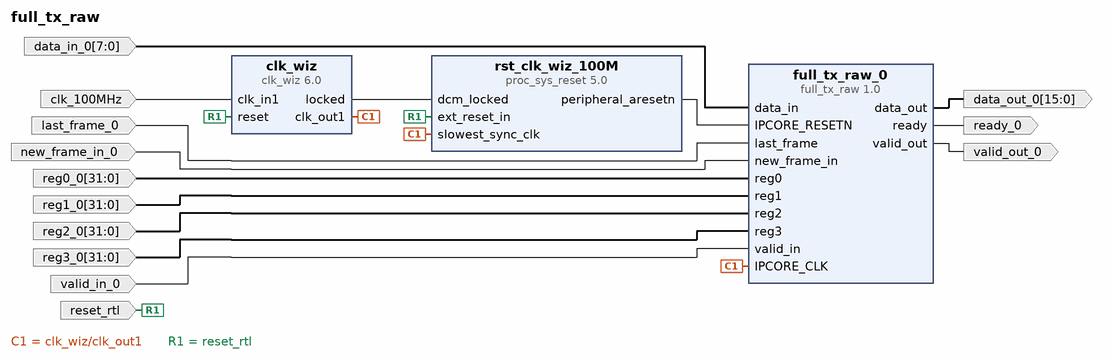
[diagram p0: block diagram of the top level]
# Vivado block design full_tx_raw, xc7z010clg400-1, Vivado 2023.2
create_bd_design full_tx_raw

create_bd_port -dir I -type clk clk_100MHz
set_property -dict {CONFIG.FREQ_HZ 100000000} [get_bd_ports clk_100MHz]
create_bd_port -dir I -type rst reset_rtl
set_property -dict {CONFIG.POLARITY ACTIVE_HIGH} [get_bd_ports reset_rtl]
create_bd_port -dir I -from 7 -to 0 data_in_0
create_bd_port -dir O -from 15 -to 0 data_out_0
create_bd_port -dir I last_frame_0
create_bd_port -dir I new_frame_in_0
create_bd_port -dir O ready_0
create_bd_port -dir I -from 31 -to 0 reg0_0
create_bd_port -dir I -from 31 -to 0 reg1_0
create_bd_port -dir I -from 31 -to 0 reg2_0
create_bd_port -dir I -from 31 -to 0 reg3_0
create_bd_port -dir I valid_in_0
create_bd_port -dir O valid_out_0

create_bd_cell -type ip -vlnv user.org:ip:full_tx_raw:1.0 full_tx_raw_0
create_bd_cell -type ip -vlnv xilinx.com:ip:clk_wiz:6.0 clk_wiz
create_bd_cell -type ip -vlnv xilinx.com:ip:proc_sys_reset:5.0 rst_clk_wiz_100M

# ---- connections ----

connect_bd_net [get_bd_ports clk_100MHz] [get_bd_pins clk_wiz/clk_in1]
connect_bd_net [get_bd_pins clk_wiz/clk_out1] [get_bd_pins full_tx_raw_0/IPCORE_CLK] [get_bd_pins rst_clk_wiz_100M/slowest_sync_clk]
connect_bd_net [get_bd_pins clk_wiz/locked] [get_bd_pins rst_clk_wiz_100M/dcm_locked]
connect_bd_net -net data_in_0_1 [get_bd_ports data_in_0] [get_bd_pins full_tx_raw_0/data_in]
connect_bd_net [get_bd_pins full_tx_raw_0/data_out] [get_bd_ports data_out_0]
connect_bd_net [get_bd_pins full_tx_raw_0/ready] [get_bd_ports ready_0]
connect_bd_net [get_bd_pins full_tx_raw_0/valid_out] [get_bd_ports valid_out_0]
connect_bd_net -net last_frame_0_1 [get_bd_ports last_frame_0] [get_bd_pins full_tx_raw_0/last_frame]
connect_bd_net -net new_frame_in_0_1 [get_bd_ports new_frame_in_0] [get_bd_pins full_tx_raw_0/new_frame_in]
connect_bd_net -net reg0_0_1 [get_bd_ports reg0_0] [get_bd_pins full_tx_raw_0/reg0]
connect_bd_net -net reg1_0_1 [get_bd_ports reg1_0] [get_bd_pins full_tx_raw_0/reg1]
connect_bd_net -net reg2_0_1 [get_bd_ports reg2_0] [get_bd_pins full_tx_raw_0/reg2]
connect_bd_net -net reg3_0_1 [get_bd_ports reg3_0] [get_bd_pins full_tx_raw_0/reg3]
connect_bd_net [get_bd_ports reset_rtl] [get_bd_pins clk_wiz/reset] [get_bd_pins rst_clk_wiz_100M/ext_reset_in]
connect_bd_net [get_bd_pins rst_clk_wiz_100M/peripheral_aresetn] [get_bd_pins full_tx_raw_0/IPCORE_RESETN]
connect_bd_net -net valid_in_0_1 [get_bd_ports valid_in_0] [get_bd_pins full_tx_raw_0/valid_in]

validate_bd_design
save_bd_design
